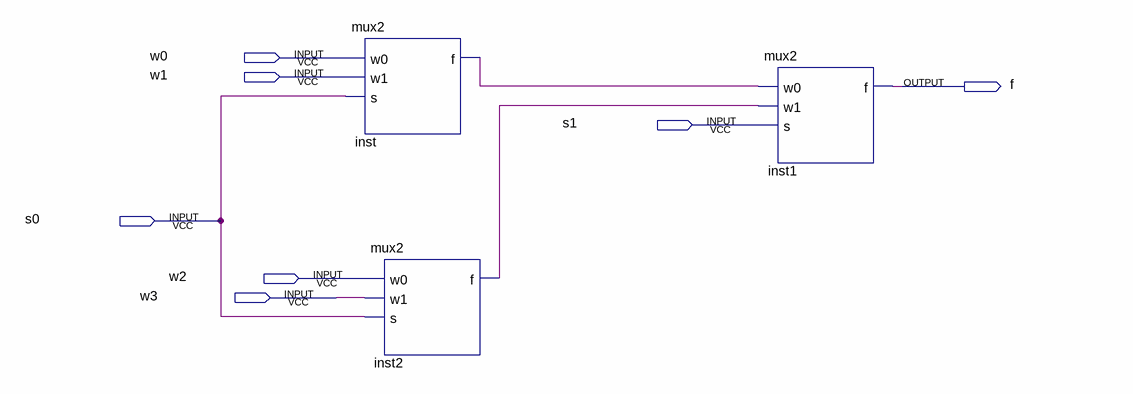
[diagram p0: schematic sheet]
// Quartus schematic 4-1mux.bdf as structural Verilog: 3 symbols, 7 pins
module \4-1mux  (
  input  w0,
  input  w1,
  input  s1,
  input  s0,
  input  w2,
  input  w3,
  output f
);

  wire inst2_f, inst_f;

  mux2 inst (.w0(w0), .w1(w1), .s(s0), .f(inst_f));
  mux2 inst2 (.w0(w2), .w1(w3), .s(s0), .f(inst2_f));
  mux2 inst1 (.w0(inst_f), .w1(inst2_f), .s(s1), .f(f));
endmodule
